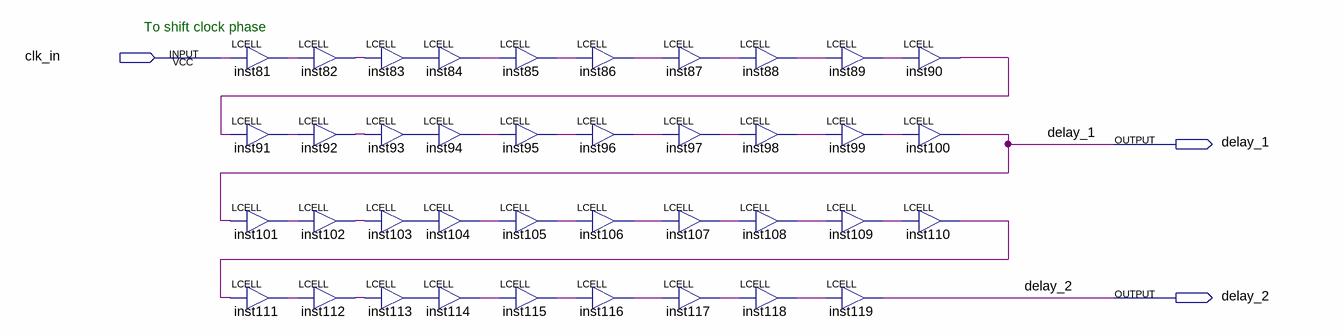
[diagram p0: schematic sheet]
// Quartus schematic delay_chain.bdf as structural Verilog: 39 symbols, 3 pins
module delay_chain (
  input  clk_in,
  output delay_1,
  output delay_2
);

  wire inst81_out, inst82_out, inst83_out, inst84_out, inst85_out, inst86_out, inst87_out, inst88_out,
       inst89_out, inst90_out, inst91_out, inst92_out, inst93_out, inst94_out, inst95_out, inst96_out,
       inst97_out, inst98_out, inst99_out, inst101_out, inst102_out, inst103_out, inst104_out, inst105_out,
       inst106_out, inst107_out, inst108_out, inst109_out, inst110_out, inst111_out, inst112_out,
       inst113_out, inst114_out, inst115_out, inst116_out, inst117_out, inst118_out;

  LCELL inst81 (.IN(clk_in), .OUT(inst81_out));
  LCELL inst82 (.IN(inst81_out), .OUT(inst82_out));
  LCELL inst91 (.IN(inst90_out), .OUT(inst91_out));
  LCELL inst92 (.IN(inst91_out), .OUT(inst92_out));
  LCELL inst101 (.IN(delay_1), .OUT(inst101_out));
  LCELL inst102 (.IN(inst101_out), .OUT(inst102_out));
  LCELL inst111 (.IN(inst110_out), .OUT(inst111_out));
  LCELL inst112 (.IN(inst111_out), .OUT(inst112_out));
  LCELL inst83 (.IN(inst82_out), .OUT(inst83_out));
  LCELL inst93 (.IN(inst92_out), .OUT(inst93_out));
  LCELL inst103 (.IN(inst102_out), .OUT(inst103_out));
  LCELL inst113 (.IN(inst112_out), .OUT(inst113_out));
  LCELL inst84 (.IN(inst83_out), .OUT(inst84_out));
  LCELL inst94 (.IN(inst93_out), .OUT(inst94_out));
  LCELL inst104 (.IN(inst103_out), .OUT(inst104_out));
  LCELL inst114 (.IN(inst113_out), .OUT(inst114_out));
  LCELL inst85 (.IN(inst84_out), .OUT(inst85_out));
  LCELL inst95 (.IN(inst94_out), .OUT(inst95_out));
  LCELL inst105 (.IN(inst104_out), .OUT(inst105_out));
  LCELL inst115 (.IN(inst114_out), .OUT(inst115_out));
  LCELL inst86 (.IN(inst85_out), .OUT(inst86_out));
  LCELL inst96 (.IN(inst95_out), .OUT(inst96_out));
  LCELL inst106 (.IN(inst105_out), .OUT(inst106_out));
  LCELL inst116 (.IN(inst115_out), .OUT(inst116_out));
  LCELL inst87 (.IN(inst86_out), .OUT(inst87_out));
  LCELL inst97 (.IN(inst96_out), .OUT(inst97_out));
  LCELL inst107 (.IN(inst106_out), .OUT(inst107_out));
  LCELL inst117 (.IN(inst116_out), .OUT(inst117_out));
  LCELL inst88 (.IN(inst87_out), .OUT(inst88_out));
  LCELL inst98 (.IN(inst97_out), .OUT(inst98_out));
  LCELL inst108 (.IN(inst107_out), .OUT(inst108_out));
  LCELL inst118 (.IN(inst117_out), .OUT(inst118_out));
  LCELL inst89 (.IN(inst88_out), .OUT(inst89_out));
  LCELL inst99 (.IN(inst98_out), .OUT(inst99_out));
  LCELL inst109 (.IN(inst108_out), .OUT(inst109_out));
  LCELL inst119 (.IN(inst118_out), .OUT(delay_2));
  LCELL inst90 (.IN(inst89_out), .OUT(inst90_out));
  LCELL inst100 (.IN(inst99_out), .OUT(delay_1));
  LCELL inst110 (.IN(inst109_out), .OUT(inst110_out));

  // Notes on the sheet:
  //   To shift clock phase 
endmodule
